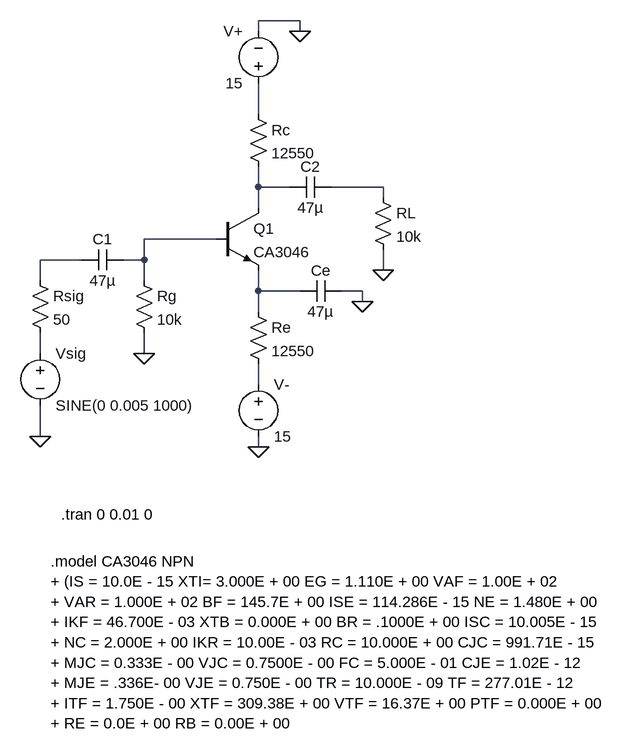
[diagram p0: schematic F1b.asc]
F1b.asc, the LTspice schematic file:
Version 4.1
SHEET 1 880 800
WIRE 320 -272 256 -272
WIRE 256 -256 256 -272
WIRE 320 -256 320 -272
WIRE 256 -128 256 -176
WIRE 256 -16 256 -48
WIRE 304 -16 256 -16
WIRE 448 -16 368 -16
WIRE 448 0 448 -16
WIRE 256 16 256 -16
WIRE 192 64 80 64
WIRE -16 96 -80 96
WIRE 80 96 80 64
WIRE 80 96 48 96
WIRE 448 112 448 80
WIRE -80 128 -80 96
WIRE 80 128 80 96
WIRE 256 144 256 112
WIRE 320 144 256 144
WIRE 416 144 384 144
WIRE 416 160 416 144
WIRE 256 176 256 144
WIRE -80 240 -80 208
WIRE 80 240 80 208
WIRE 256 288 256 256
WIRE -80 368 -80 320
WIRE 256 384 256 368
FLAG -80 368 0
FLAG 80 240 0
FLAG 416 160 0
FLAG 448 112 0
FLAG 320 -256 0
FLAG 256 384 0
SYMBOL voltage -80 224 R0
WINDOW 123 0 0 Left 0
WINDOW 39 0 0 Left 0
SYMATTR InstName Vsig
SYMATTR Value SINE(0 0.005 1000)
SYMBOL res -96 112 R0
SYMATTR InstName Rsig
SYMATTR Value 50
SYMBOL cap 48 80 R90
WINDOW 0 0 32 VBottom 2
WINDOW 3 32 32 VTop 2
SYMATTR InstName C1
SYMATTR Value 47µ
SYMBOL res 64 112 R0
SYMATTR InstName Rg
SYMATTR Value 10k
SYMBOL res 240 160 R0
SYMATTR InstName Re
SYMATTR Value 12550
SYMBOL res 240 -144 R0
SYMATTR InstName Rc
SYMATTR Value 12550
SYMBOL res 432 -16 R0
SYMATTR InstName RL
SYMATTR Value 10k
SYMBOL cap 368 -32 R90
WINDOW 0 0 32 VBottom 2
WINDOW 3 32 32 VTop 2
SYMATTR InstName C2
SYMATTR Value 47µ
SYMBOL cap 384 128 R90
WINDOW 0 0 32 VBottom 2
WINDOW 3 32 32 VTop 2
SYMATTR InstName Ce
SYMATTR Value 47µ
SYMBOL voltage 256 -160 R180
WINDOW 0 24 96 Left 2
WINDOW 3 24 16 Left 2
SYMATTR InstName V+
SYMATTR Value 15
SYMBOL voltage 256 272 R0
SYMATTR InstName V-
SYMATTR Value 15
SYMBOL npn 192 16 R0
SYMATTR InstName Q1
SYMATTR Value CA3046
TEXT -48 488 Left 2 !.tran 0 0.01 0
TEXT -64 560 Left 2 !.model CA3046 NPN\n+ (IS = 10.0E - 15 XTI= 3.000E + 00 EG = 1.110E + 00 VAF = 1.00E + 02\n+ VAR = 1.000E + 02 BF = 145.7E + 00 ISE = 114.286E - 15 NE = 1.480E + 00\n+ IKF = 46.700E - 03 XTB = 0.000E + 00 BR = .1000E + 00 ISC = 10.005E - 15\n+ NC = 2.000E + 00 IKR = 10.00E - 03 RC = 10.000E + 00 CJC = 991.71E - 15\n+ MJC = 0.333E - 00 VJC = 0.7500E - 00 FC = 5.000E - 01 CJE = 1.02E - 12\n+ MJE = .336E- 00 VJE = 0.750E - 00 TR = 10.000E - 09 TF = 277.01E - 12\n+ ITF = 1.750E - 00 XTF = 309.38E + 00 VTF = 16.37E + 00 PTF = 0.000E + 00\n+ RE = 0.0E + 00 RB = 0.00E + 00

The netlist it stands for:
* F1b.asc
Vsig N007 0 SINE(0 0.005 1000)
Rsig N005 N007 50
C1 N004 N005 47µ
Rg N004 0 10k
Re N006 N008 12550
Rc N001 N002 12550
RL N003 0 10k
C2 N003 N002 47µ
Ce 0 N006 47µ
V+ N001 0 15
V- N008 0 15
Q1 N002 N004 N006 0 CA3046
.model NPN NPN
.model PNP PNP
.lib standard.bjt
.tran 0 0.01 0
.model CA3046 NPN
+ (IS = 10.0E - 15 XTI= 3.000E + 00 EG = 1.110E + 00 VAF = 1.00E + 02
+ VAR = 1.000E + 02 BF = 145.7E + 00 ISE = 114.286E - 15 NE = 1.480E + 00
+ IKF = 46.700E - 03 XTB = 0.000E + 00 BR = .1000E + 00 ISC = 10.005E - 15
+ NC = 2.000E + 00 IKR = 10.00E - 03 RC = 10.000E + 00 CJC = 991.71E - 15
+ MJC = 0.333E - 00 VJC = 0.7500E - 00 FC = 5.000E - 01 CJE = 1.02E - 12
+ MJE = .336E- 00 VJE = 0.750E - 00 TR = 10.000E - 09 TF = 277.01E - 12
+ ITF = 1.750E - 00 XTF = 309.38E + 00 VTF = 16.37E + 00 PTF = 0.000E + 00
+ RE = 0.0E + 00 RB = 0.00E + 00
.backanno
.end